# Altium schematic sheet MICRO.SchDoc: OCULUS RIFT DEVELOPMENT KIT 2 (DK2) MAIN BOARD
size B; Date: 12 MAR 2014; Author: L. BAINBRIDGE; CompanyName: Oculus VR, Inc.; DrawnBy: L. BAINBRIDGE; Engineer: L. BAINBRIDGE; Organization: Oculus VR, Inc.; DocumentNumber: 2; Revision: 3.3; SheetNumber: 2; SheetTotal: 6; PageSetup: Record=PageOptions|CenterHorizontal=True|CenterVertical=True|PrintScale=1.12|XCorrection=1.00|YCorrection=1.00|PrintKind=1|BorderSize=5000000|LeftOffset=0|BottomOffset=0|Orientation=2|PaperLength=1000|PaperWidth=1000|Scale=100|PaperSource=15|PrintQuality=1200|MediaType=1|DitherType=0|PaperKind=11 x 17|PrintScaleMode=1; SheetDescription: MICROCONTROLLER AND SUPPORTING CIRCUITS; PartNumber: N/A; ProjectName: DK2
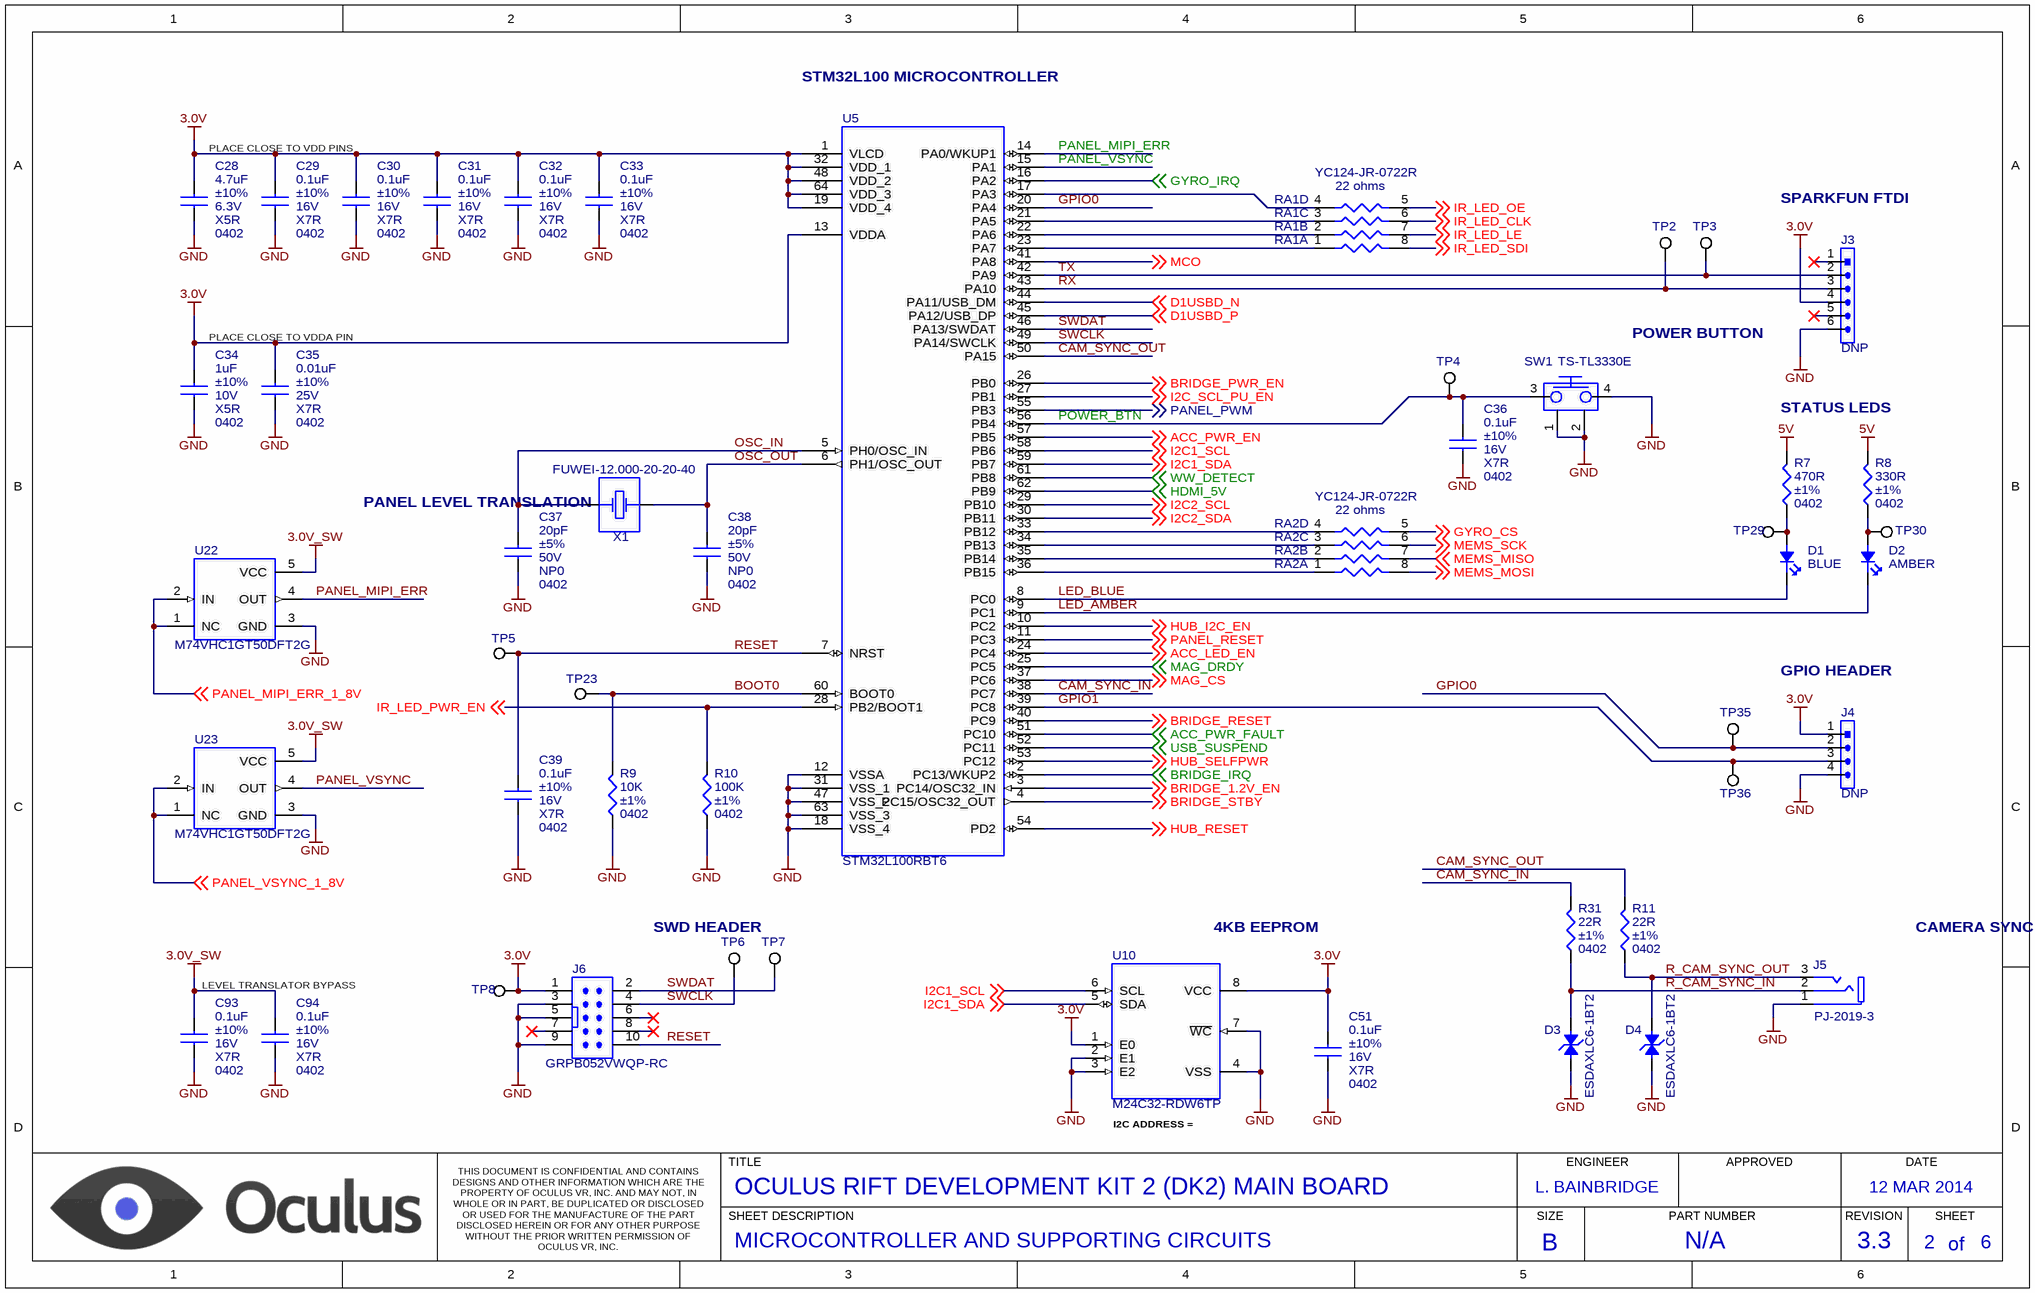
[diagram p0: MICRO.SchDoc]

## Parts
C28  4.7uF  Tolerance: ±10%  Voltage: 6.3V  Dielectric: X5R  Package: 0402  [CAP_CERAMIC_0402]
C29  0.1uF  Tolerance: ±10%  Voltage: 16V  Dielectric: X7R  Package: 0402  [CAP_CERAMIC_0402]
C30  0.1uF  Tolerance: ±10%  Voltage: 16V  Dielectric: X7R  Package: 0402  [CAP_CERAMIC_0402]
C31  0.1uF  Tolerance: ±10%  Voltage: 16V  Dielectric: X7R  Package: 0402  [CAP_CERAMIC_0402]
C32  0.1uF  Tolerance: ±10%  Voltage: 16V  Dielectric: X7R  Package: 0402  [CAP_CERAMIC_0402]
C33  0.1uF  Tolerance: ±10%  Voltage: 16V  Dielectric: X7R  Package: 0402  [CAP_CERAMIC_0402]
C34  1uF  Tolerance: ±10%  Voltage: 10V  Dielectric: X5R  Package: 0402  [CAP_CERAMIC_0402]
C35  0.01uF  Tolerance: ±10%  Voltage: 25V  Dielectric: X7R  Package: 0402  [CAP_CERAMIC_0402]
C36  0.1uF  Tolerance: ±10%  Voltage: 16V  Dielectric: X7R  Package: 0402  [CAP_CERAMIC_0402]
C37  20pF  Tolerance: ±5%  Voltage: 50V  Dielectric: NP0  Package: 0402  [CAP_CERAMIC_0402]
C38  20pF  Tolerance: ±5%  Voltage: 50V  Dielectric: NP0  Package: 0402  [CAP_CERAMIC_0402]
C39  0.1uF  Tolerance: ±10%  Voltage: 16V  Dielectric: X7R  Package: 0402  [CAP_CERAMIC_0402]
C51  0.1uF  Tolerance: ±10%  Voltage: 16V  Dielectric: X7R  Package: 0402  [CAP_CERAMIC_0402]
C93  0.1uF  Tolerance: ±10%  Voltage: 16V  Dielectric: X7R  Package: 0402  [CAP_CERAMIC_0402]
C94  0.1uF  Tolerance: ±10%  Voltage: 16V  Dielectric: X7R  Package: 0402  [CAP_CERAMIC_0402]
D1  Color: BLUE  [LED_BLUE_0603]  (hidden comment: LED)
D2  Color: AMBER  [LED_AMBER_0603]  (hidden comment: LED)
D3  ESDAXLC6-1BT2  [SOD-882T]
D4  ESDAXLC6-1BT2  [SOD-882T]
J3  DNP  [HEADER_1X6]  (no BOM)
J4  DNP  [HEADER_1X4]  (no BOM)
J5  PJ-2019-3  [PJ-2019-3]
J6  GRPB052VWQP-RC  [GRPB052VWQP-RC]  (no BOM)
R7  470R  Package: 0402  Tolerance: ±1%  [RESISTOR_0402]
R8  330R  Package: 0402  Tolerance: ±1%  [RESISTOR_0402]
R9  10K  Package: 0402  Tolerance: ±1%  [RESISTOR_0402]
R10  100K  Package: 0402  Tolerance: ±1%  [RESISTOR_0402]
R11  22R  Package: 0402  Tolerance: ±1%  [RESISTOR_0402]
R31  22R  Package: 0402  Tolerance: ±1%  [RESISTOR_0402]
RA1  YC124-JR-0722R  value 22 ohms  [YC124]  (parts A,B,C,D of 4)
RA2  YC124-JR-0722R  value 22 ohms  [YC124]  (parts A,B,C,D of 4)
SW1  TS-TL3330E  [TS-TL3330E]
TP2  TEST POINT  [TEST_POINT_PAD_1.2X3MM]  (value not drawn)  (no BOM)
TP3  TEST POINT  [TEST_POINT_PAD_1.2X3MM]  (value not drawn)  (no BOM)
TP4  TEST POINT  [TEST_POINT_PAD_1MM]  (value not drawn)  (no BOM)
TP5  TEST POINT  [TEST_POINT_PAD_1MM]  (value not drawn)  (no BOM)
TP6  TEST POINT  [TEST_POINT_PAD_1MM]  (value not drawn)  (no BOM)
TP7  TEST POINT  [TEST_POINT_PAD_1MM]  (value not drawn)  (no BOM)
TP8  TEST POINT  [TEST_POINT_PAD_1MM]  (value not drawn)  (no BOM)
TP23  TEST POINT  [TEST_POINT_PAD_1MM]  (value not drawn)  (no BOM)
TP29  TEST POINT  [TEST_POINT_PAD_1MM]  (value not drawn)  (no BOM)
TP30  TEST POINT  [TEST_POINT_PAD_1MM]  (value not drawn)  (no BOM)
TP35  TEST POINT  [TEST_POINT_PAD_1.2X3MM]  (value not drawn)  (no BOM)
TP36  TEST POINT  [TEST_POINT_PAD_1MM]  (value not drawn)  (no BOM)
U5  STM32L100RBT6  [LQFP64]
U10  M24C32-RDW6TP  [TSSOP8]
U22  M74VHC1GT50DFT2G  [SC70-5]
U23  M74VHC1GT50DFT2G  [SC70-5]
X1  FUWEI-12.000-20-20-40  [HC-49USX]

## Nets
3.0V: C28.1 C29.1 C30.1 C31.1 C32.1 C33.1 C34.1 C35.1 C51.1 J3.4 J4.1 J6.1 TP8.1 U5.1(VLCD) U5.13(VDDA) U5.19(VDD_4) U5.32(VDD_1) U5.48(VDD_2) U5.64(VDD_3) U10.1(E0) U10.8(VCC)
3.0V_SW: C93.1 C94.1 U22.5(VCC) U23.5(VCC)
5V: R7.2 R8.2
GND: C28.2 C29.2 C30.2 C31.2 C32.2 C33.2 C34.2 C35.2 C36.2 C37.2 C38.2 C39.2 C51.2 C93.2 C94.2 D3.2 D4.2 J3.6 J4.4 J5.1 J6.3 J6.5 J6.9 R9.1 R10.1 SW1.1 SW1.2 SW1.4 U5.12(VSSA) U5.18(VSS_4) U5.31(VSS_1) U5.47(VSS_2) U5.63(VSS_3) U10.2(E1) U10.3(E2) U10.4(VSS) U10.7(~{WC}) U22.3(GND) U23.3(GND)
ACC_LED_EN: U5.24(PC4) ; off-sheet ACC_LED_EN
ACC_PWR_EN: U5.57(PB5) ; off-sheet ACC_PWR_EN
ACC_PWR_FAULT: U5.51(PC10) ; off-sheet ACC_PWR_FAULT
BOOT0: R9.2 TP23.1 U5.60(BOOT0)
BRIDGE_1.2V_EN: U5.3(PC14/OSC32_IN) ; off-sheet BRIDGE_1.2V_EN
BRIDGE_IRQ: U5.2(PC13/WKUP2) ; off-sheet BRIDGE_IRQ
BRIDGE_PWR_EN: U5.26(PB0) ; off-sheet BRIDGE_PWR_EN
BRIDGE_RESET: U5.40(PC9) ; off-sheet BRIDGE_RESET
BRIDGE_STBY: U5.4(PC15/OSC32_OUT) ; off-sheet BRIDGE_STBY
CAM_SYNC_IN: R31.1 U5.38(PC7)
CAM_SYNC_OUT: R11.1 U5.50(PA15)
D1USBD_N: U5.44(PA11/USB_DM) ; off-sheet D1USBD_N
D1USBD_P: U5.45(PA12/USB_DP) ; off-sheet D1USBD_P
GPIO0: J4.2 TP35.1 U5.20(PA4)
GPIO1: J4.3 TP36.1 U5.39(PC8)
GYRO_CS: RA2.5 ; off-sheet GYRO_CS
GYRO_IRQ: U5.16(PA2) ; off-sheet GYRO_IRQ
HDMI_5V: U5.62(PB9) ; off-sheet HDMI_5V
HUB_I2C_EN: U5.10(PC2) ; off-sheet HUB_I2C_EN
HUB_RESET: U5.54(PD2) ; off-sheet HUB_RESET
HUB_SELFPWR: U5.53(PC12) ; off-sheet HUB_SELFPWR
I2C1_SCL: U5.58(PB6) U10.6(SCL) ; off-sheet I2C1_SCL
I2C1_SDA: U5.59(PB7) U10.5(SDA) ; off-sheet I2C1_SDA
I2C2_SCL: U5.29(PB10) ; off-sheet I2C2_SCL
I2C2_SDA: U5.30(PB11) ; off-sheet I2C2_SDA
I2C_SCL_PU_EN: U5.27(PB1) ; off-sheet I2C_SCL_PU_EN
IR_LED_CLK: RA1.6 ; off-sheet IR_LED_CLK
IR_LED_LE: RA1.7 ; off-sheet IR_LED_LE
IR_LED_OE: RA1.5 ; off-sheet IR_LED_OE
IR_LED_PWR_EN: R10.2 U5.28(PB2/BOOT1) ; off-sheet IR_LED_PWR_EN
IR_LED_SDI: RA1.8 ; off-sheet IR_LED_SDI
LED_AMBER: D2.2(K) U5.9(PC1)
LED_BLUE: D1.2(K) U5.8(PC0)
MAG_CS: U5.37(PC6) ; off-sheet MAG_CS
MAG_DRDY: U5.25(PC5) ; off-sheet MAG_DRDY
MCO: U5.41(PA8) ; off-sheet MCO
MEMS_MISO: RA2.7 ; off-sheet MEMS_MISO
MEMS_MOSI: RA2.8 ; off-sheet MEMS_MOSI
MEMS_SCK: RA2.6 ; off-sheet MEMS_SCK
OSC_IN: C37.1 U5.5(PH0/OSC_IN) X1.1
OSC_OUT: C38.1 U5.6(PH1/OSC_OUT) X1.2
PANEL_MIPI_ERR: U5.14(PA0/WKUP1) U22.4(OUT)
PANEL_MIPI_ERR_1_8V: U22.1(NC) U22.2(IN) ; off-sheet PANEL_MIPI_ERR_1_8V
PANEL_PWM: U5.55(PB3) ; off-sheet PANEL_PWM
PANEL_RESET: U5.11(PC3) ; off-sheet PANEL_RESET
PANEL_VSYNC: U5.15(PA1) U23.4(OUT)
PANEL_VSYNC_1_8V: U23.1(NC) U23.2(IN) ; off-sheet PANEL_VSYNC_1_8V
POWER_BTN: C36.1 SW1.3 TP4.1 U5.56(PB4)
R_CAM_SYNC_IN: D3.1 J5.2 R31.2
R_CAM_SYNC_OUT: D4.1 J5.3 R11.2
RESET: C39.1 J6.10 TP5.1 U5.7(NRST)
RX: J3.3 TP2.1 U5.43(PA10)
SWCLK: J6.4 TP6.1 U5.49(PA14/SWCLK)
SWDAT: J6.2 TP7.1 U5.46(PA13/SWDAT)
TX: J3.2 TP3.1 U5.42(PA9)
USB_SUSPEND: U5.52(PC11) ; off-sheet USB_SUSPEND
WW_DETECT: U5.61(PB8) ; off-sheet WW_DETECT
NetD1_1: D1.1(A) R7.1 TP29.1
NetD2_1: D2.1(A) R8.1 TP30.1
NetRA1_1: RA1.1 U5.23(PA7)
NetRA1_2: RA1.2 U5.22(PA6)
NetRA1_3: RA1.3 U5.21(PA5)
NetRA1_4: RA1.4 U5.17(PA3)
NetRA2_1: RA2.1 U5.36(PB15)
NetRA2_2: RA2.2 U5.35(PB14)
NetRA2_3: RA2.3 U5.34(PB13)
NetRA2_4: RA2.4 U5.33(PB12)

Not connected (* = marked no-connect by the designer): J3 1* 5*; J6 6* 7* 8*

## Notes on the sheet
- STM32L100 MICROCONTROLLER
- PLACE CLOSE TO VDD PINS
- SPARKFUN FTDI
- PLACE CLOSE TO VDDA PIN
- POWER BUTTON
- STATUS LEDS
- PANEL LEVEL TRANSLATION
- GPIO HEADER
- SWD HEADER
- 4KB EEPROM
- (near J5) CAMERA SYNC JACK
- LEVEL TRANSLATOR BYPASS CAPS
- (near U10) I2C ADDRESS = 0xA2
- TITLE
- ENGINEER
- APPROVED
- DATE
- THIS DOCUMENT IS CONFIDENTIAL AND CONTAINS DESIGNS AND OTHER INFORMATION WHICH ARE THE PROPERTY OF OCULUS VR, INC. AND MAY NOT, IN WHOLE OR IN PART, BE DUPLICATED OR DISCLOSED OR USED FOR THE MANUFACTURE OF THE PART DISCLOSED HEREIN OR FOR ANY OTHER PURPOSE WITHOUT THE PRIOR WRITTEN PERMISSION OF OCULUS VR, INC.
- SHEET DESCRIPTION
- SIZE
- PART NUMBER
- REVISION
- SHEET
- of
- B

## Library data of the parts
C28 = CAP, CERAMIC: CAP, CERAMIC, 4.7uF, ±10%, 6.3V, X5R, 0402; Manufacturer: TDK CORPORATION; Part Number: C1005X5R0J475K
C29-C33 C36 C39 C51 C93 C94 = CAP, CERAMIC: CAP, CERAMIC, 0.1uF, ±10%, 16V, X7R, 0402; Manufacturer: MURATA ELECTRONICS; Part Number: GRM155R71C104KA88D
C34 = CAP, CERAMIC: CAP, CERAMIC, 1uF, ±10%, 10V, X5R, 0402; Manufacturer: MURATA ELECTRONICS; Part Number: GRM155R61A105KE15D
C35 = CAP, CERAMIC: CAP, CERAMIC, 0.01uF, ±10%, 25V, X7R, 0402; Manufacturer: MURATA ELECTRONICS; Part Number: GRM155R71E103KA01D
C37 C38 = CAP, CERAMIC: CAP, CERAMIC, 20pF, ±5%, 50V, NP0, 0402; Manufacturer: MURATA ELECTRONICS; Part Number: GRM1555C1H200JA01D
D1 = LED: LED, BLUE, 0603; Manufacturer: PANASONIC; Part Number: LNJ926W8CRA; Forward Voltage Drop: 2.9V TYP, 3.15V MAX
D2 = LED: LED, AMBER, 0603; Manufacturer: PANASONIC; Part Number: LNJ437W84RA; Forward Voltage Drop: 1.95V TYP, 2.5V MAX
D3 D4 = ESDAXLC6-1BT2: DIODE, ESD SUPPRESSOR, SINGLE LINE BI-DIRECTIONAL, LOW CAPACITANCE; Manufacturer: ST MICROELECTRONICS; Part Number: ESDAXLC6-1BT2
J3 = HEADER 1X6: CONNECTOR, HEADER, 6 POS, 1X6, 0.1" PITCH; Manufacturer: TBD; Part Number: TBD; Pitch: 0.1"
J4 = HEADER 1X4: CONNECTOR, HEADER, 4 POS, 1X4, 0.1" PITCH; Manufacturer: TBD; Part Number: TBD; Pitch: 0.1"
J5 = PJ-2019-3: CONNECTOR, 2.5MM STEREO AUDIO JACK; Manufacturer: BERWAY TECHNOLOGY; Part Number: PJ-2019-3
J6 = GRPB052VWQP-RC: CONNECTOR, 10 POS, ARM CORTEX SWD HEADER; Manufacturer: SULLINS CONNECTOR; Part Number: GRPB052VWQP-RC
R7 = RESISTOR: RES, 470 OHM, 1/10W, ±1%, 0402; Manufacturer: PANASONIC; Part Number: ERJ-2RKF4700X; Power Rating: 1/10W
R8 = RESISTOR: RES, 330 OHM, 1/10W, ±1%, 0402; Manufacturer: PANASONIC; Part Number: ERJ-2RKF3300X; Power Rating: 1/10W
R9 = RESISTOR: RES, 10K OHM, 1/10W, ±1%, 0402; Manufacturer: PANASONIC; Part Number: ERJ-2RKF1002X; Power Rating: 1/10W
R10 = RESISTOR: RES, 100K OHM, 1/10W, ±1%, 0402; Manufacturer: PANASONIC; Part Number: ERJ-2RKF1003X; Power Rating: 1/10W
R11 R31 = RESISTOR: RES, 22 OHM, 1/10W, ±1%, 0402; Manufacturer: PANASONIC; Part Number: ERJ-2RKF22R0X; Power Rating: 1/10W
RA1 RA2 = YC124-JR-0722R: RESISTOR ARRAY, 4 RESISTORS, 22 OHM, 5%, 0.5MM PITCH; Manufacturer: YAGEO; Part Number: YC124-JR-0722R; Pinout verified: *
SW1 = TS-TL3330E: SWITCH, TACTILE, SPST-NO, 250gf; Manufacturer: BERWAY TECHNOLOGY; Part Number: TS-TL3330E
TP2-TP8 TP23 TP29 TP30 TP35 TP36 = TEST_POINT_GENERIC: Manufacturer: *; Part Number: *
U5 = STM32L100RBT6: IC, STM32L MICROCONTROLLER, ARM CORTEX M3; Manufacturer: ST MICROELECTRONICS; Part Number: STM32L100RBT6; Verified Pinout: *
U10 = M24C32-RDW6TP: IC, EEPROM, I2C, 32 Kbits; Manufacturer: STMICROELECTRONICS; Part Number: M24C32-RDW6TP; Verified Pinout: *
U22 U23 = M74VHC1GT50DFT2G: IC, NON-INVERTING BUFFER, CMOS LOGIC LEVEL SHIFTER; Manufacturer: ON SEMICONDUCTOR; Part Number: M74VHC1GT50DFT2G; Pinout verified: *
X1 = FUWEI-12.000-20-20-40: CRYSTAL, 12MHZ, +/-30PPM, 20pF, HC-49USX; Manufacturer: BERWAY TECHNOLOGY; Part Number: FUWEI-12.000-20-20-40; Pinout Verified: *